# EAGLE design Schematic (EAGLE 9.2.0)
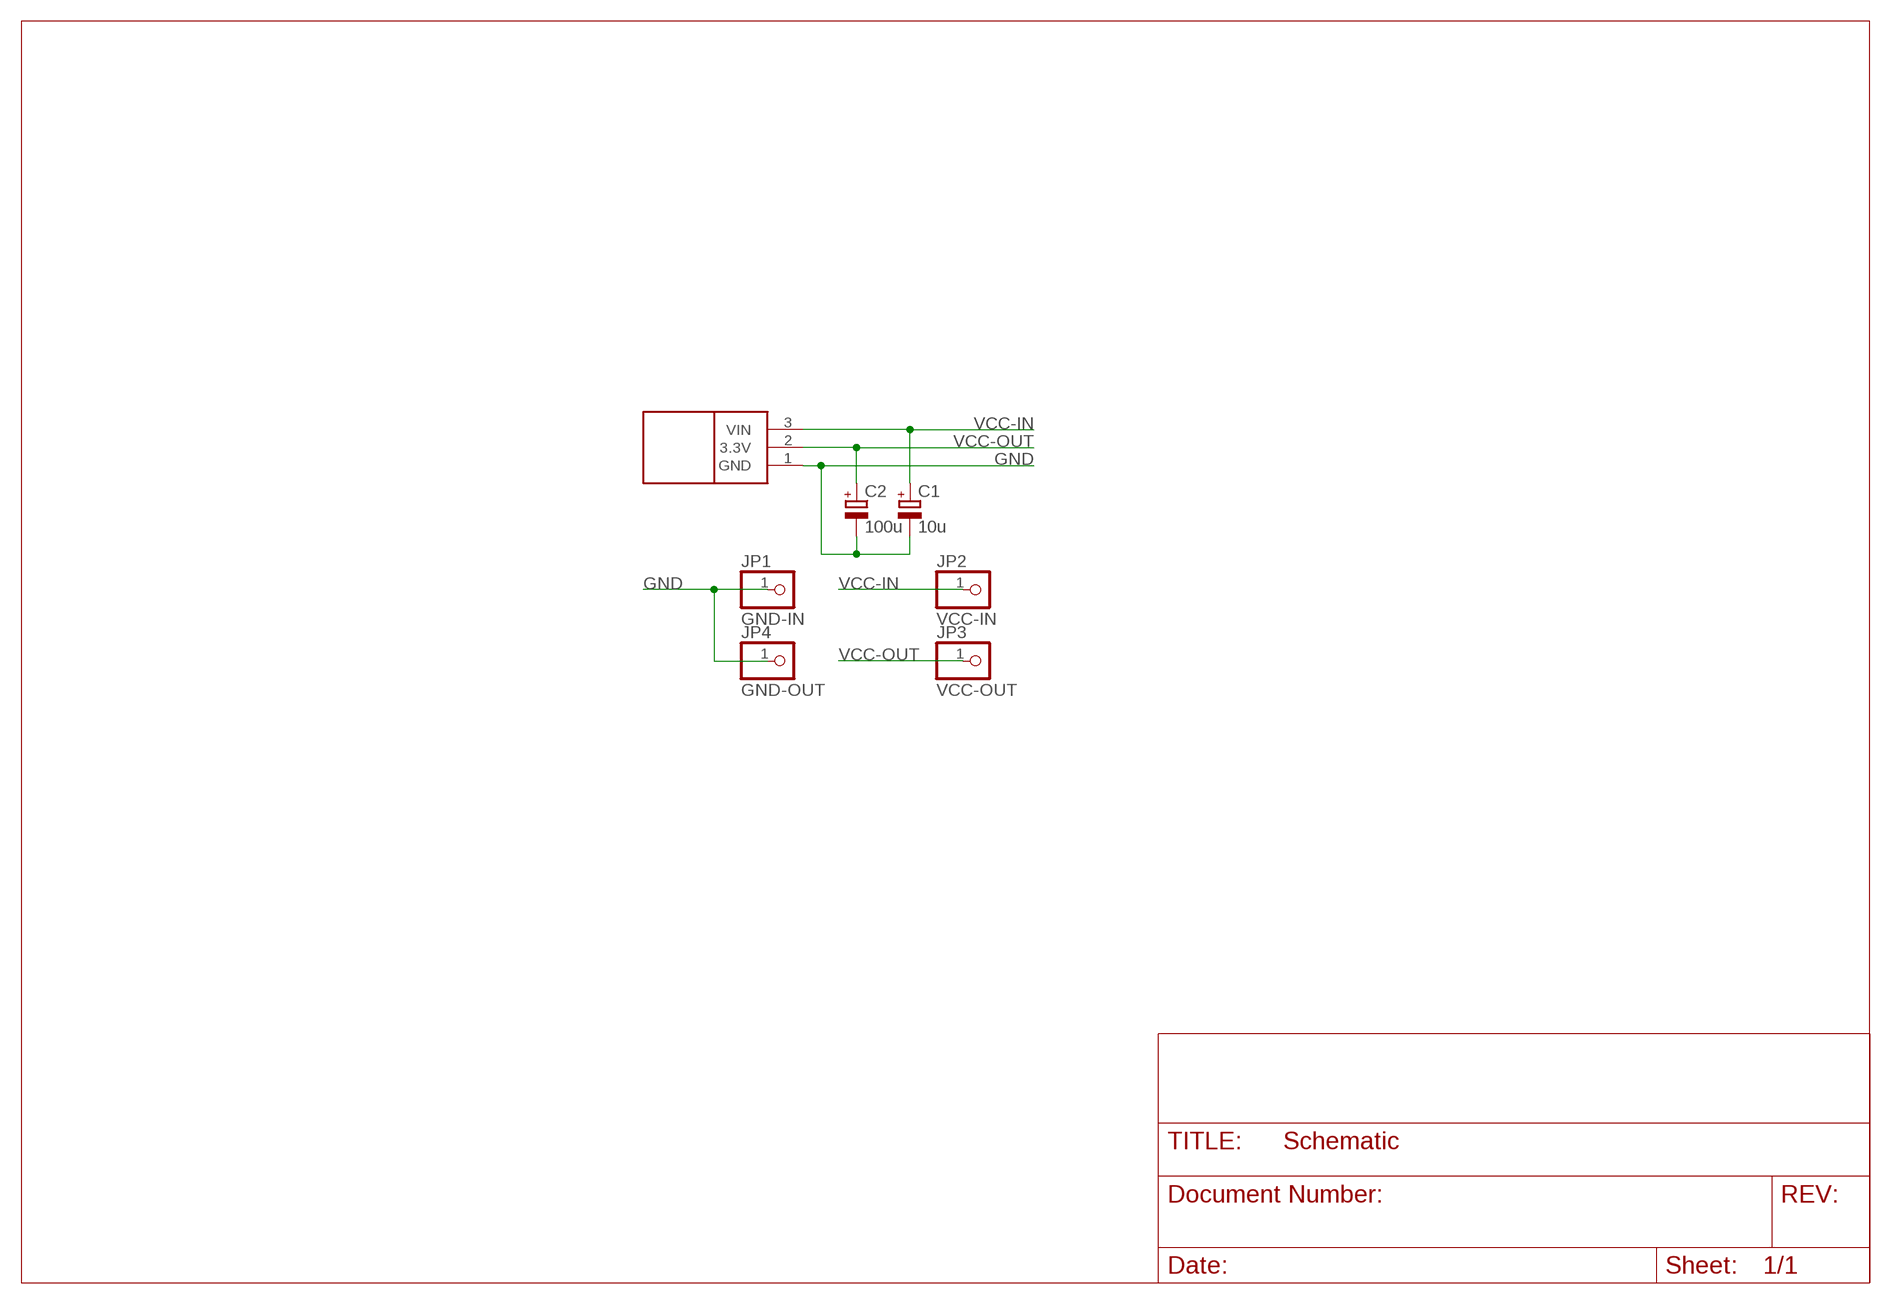
[diagram p0: schematic, sheet 1]

## Parts
C1  10u  CPOL-EUE2.5-7  [E2,5-7]
C2  100u  CPOL-EUE3.5-8  [E3,5-8]
JP1  GND-IN  PINHD-1X1  [1X01]
JP2  VCC-IN  PINHD-1X1  [1X01]
JP3  VCC-OUT  PINHD-1X1  [1X01]
JP4  GND-OUT  PINHD-1X1  [1X01]
U$1  LD33VHORIZONTAL  [TO220]

## Nets
GND: C1.- C2.- JP1.1 JP4.1 U$1.1(GND)
VCC-IN: C1.+ JP2.1 U$1.3(VIN)
VCC-OUT: C2.+ JP3.1 U$1.2(3.3V)

## Library data of the parts
C1 C2 = rcl:CPOL-EU: POLARIZED CAPACITOR, European symbol; SPICEPREFIX: C
JP1-JP4 = pinhead:PINHD-1X1: PIN HEADER
U$1 = Eigen Library:LD33V

## Board
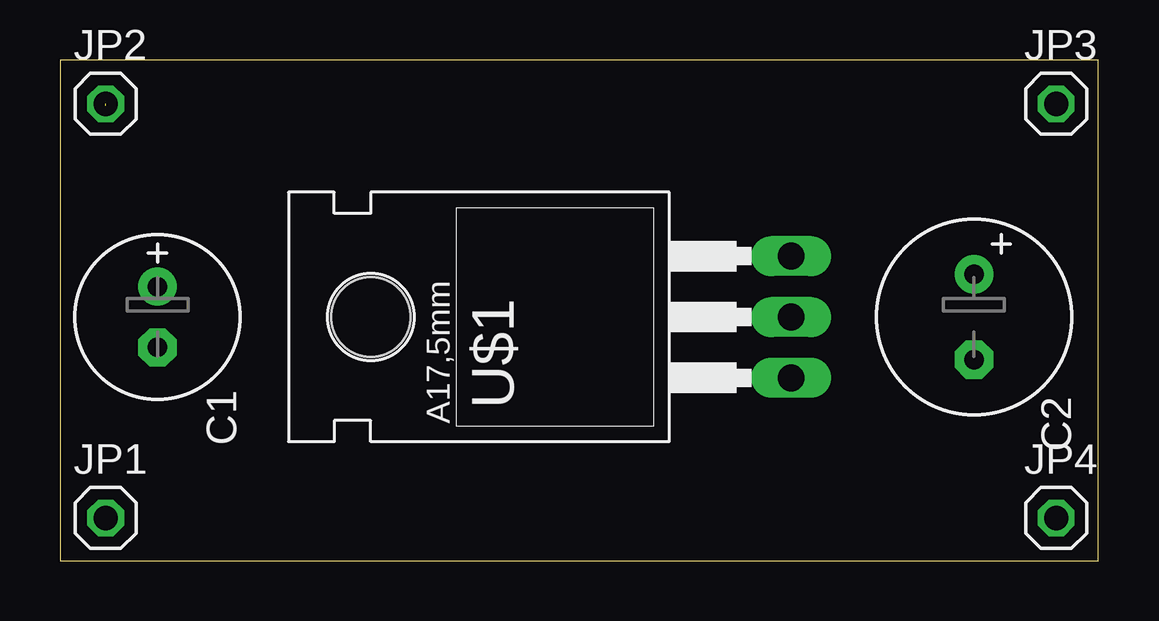
[diagram p1: board, top side]
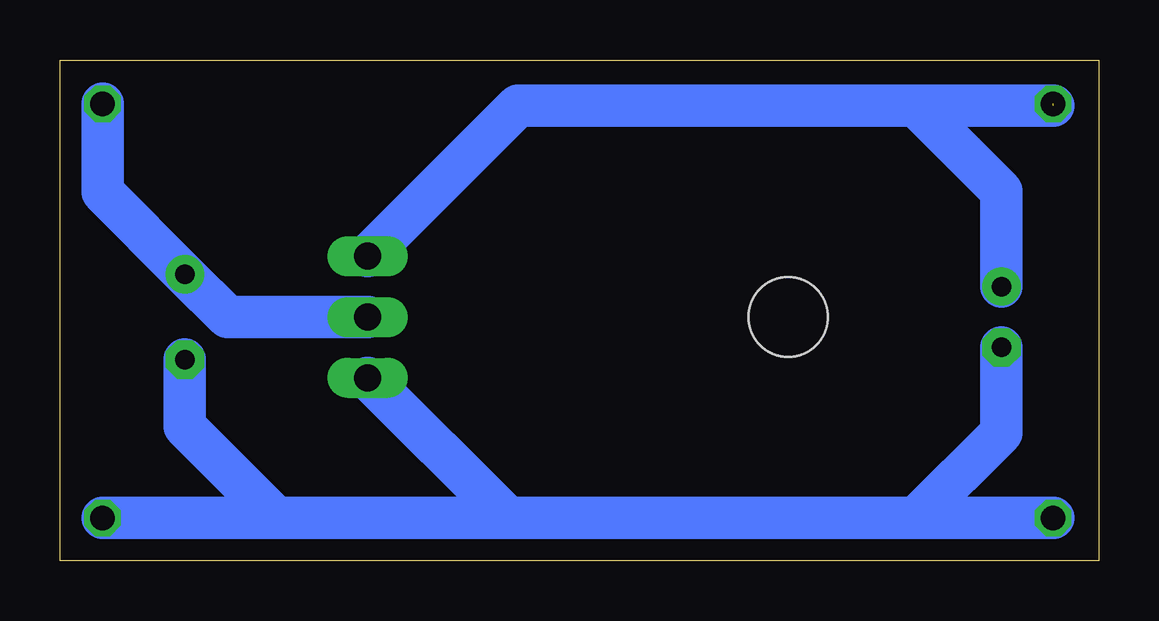
[diagram p2: board, bottom side, seen from below]

Size 43.29 x 20.88 mm. Coordinates in mm from the lower left corner, seen from the top.
Outline: 0,0 43.29,0 43.29,20.88 0,20.88 0,0
Copper layers (1*16): Top 0.035mm / dielectric 1.5mm / Bottom 0.035mm
Design rules "default": minimum track width 6mil, minimum drill 0.35mm, track to track 6mil, track to pad 6mil, pad to pad 6mil, via to via 6mil, smd to smd 6mil, copper to edge 40mil, drill to drill 6mil, minimum pad ring 10mil, minimum via ring 8mil, stop-mask expansion 4mil, vias tented up to drill 0mil, thermal gap 10mil

### Footprints (pad centres in the part's own frame; a part is rotated, then mirrored left to right if it is on the bottom)
E2,5-7 = drill 0.813 pad 1.6: + -1.27,0 | drill 0.813 pad 1.6 octagon: - 1.27,0
E3,5-8 = drill 0.813 pad 1.6: + -1.778,0 | drill 0.813 pad 1.6 octagon: - 1.778,0
1X01 = drill 1.016 octagon: 1 0,0
TO220 = drill 1.118 long: 1 -2.54,-6.35; 2 0,-6.35; 3 2.54,-6.35 | hole 3.302: 0,11.176

### Placement (x,y rotation side)
C1  4.06,10.16 270 top
C2  38.1,10.16 270 top
JP1  1.91,1.78 0 top
JP2  1.91,19.05 0 top
JP3  41.53,19.05 0 top
JP4  41.53,1.78 0 top
U$1  24.13,10.16 90 top

### Tracks (layer width: path | path; a pad name or v marks a point on that pad's centre or on a via)
GND
  Bottom 1.778: JP1.1 7.62,1.78 | 7.62,1.78 24.64,1.78 | 24.64,1.78 U$1.1 | 7.62,1.78 4.06,5.33 C1.- | JP4.1 34.29,1.78 | 34.29,1.78 24.64,1.78 | 34.29,1.78 38.1,5.59 C2.-
VCC-IN  (1 unrouted)
  Bottom 1.778: U$1.3 24.21,18.97 7.62,18.97 | 1.91,18.97 7.62,18.97 | C1.+ 4.06,15.42 7.62,18.97
VCC-OUT
  Bottom 1.778: U$1.2 36.32,10.16 C2.+ 41.53,15.37 JP3.1